# Altium schematic sheet MMI.SchDoc
size 292 x 193 mm; SheetNumber: 3; SheetTotal: 10
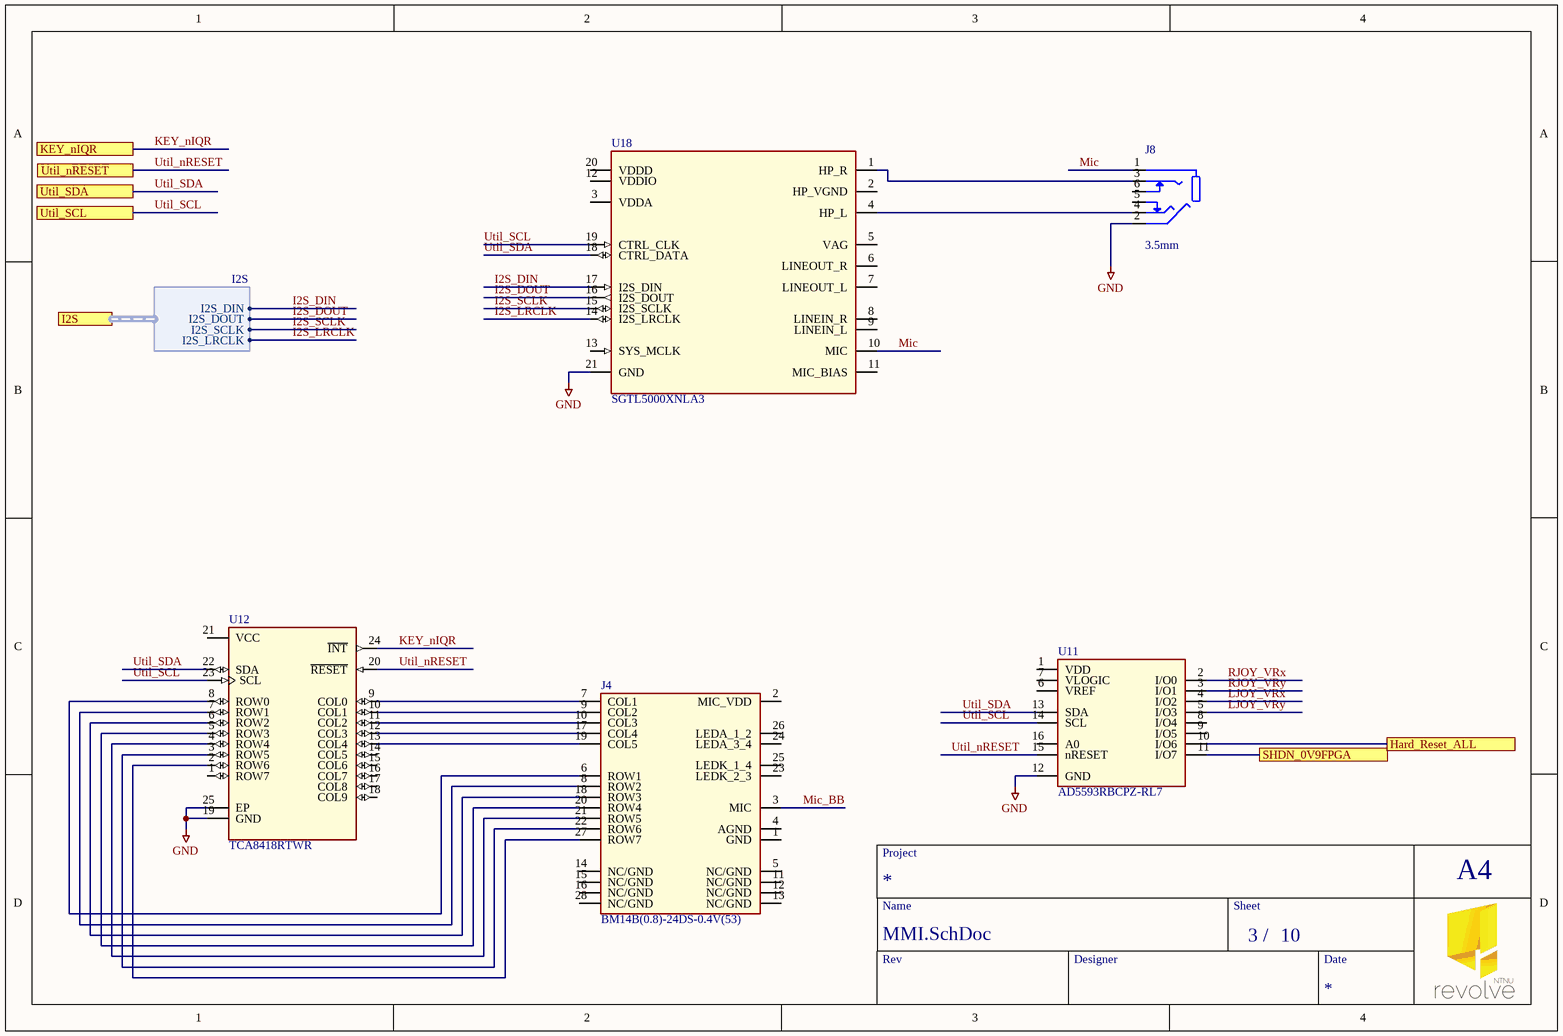
[diagram p0: MMI.SchDoc]

## Parts
J4  BM14B(0.8)-24DS-0.4V(53)  [CONN24_BM14B_HIR]
J8  3.5mm  [TENSILITY_54-00176]
U11  AD5593RBCPZ-RL7  [CP_16_32_ADI-M]
U12  TCA8418RTWR  [QFN50P400X400X80-25N]
U18  SGTL5000XNLA3  [HUQFN20_SOT1628-1_NXP-M]

## Ports
Hard_Reset_ALL, I2S (harness I2S), KEY_nIQR, SHDN_0V9FPGA, Util_nRESET, Util_SCL, Util_SDA

## Harnesses
I2S: I2S_DIN, I2S_DOUT, I2S_SCLK, I2S_LRCLK

## Nets
GND: J8.2 U11.12(GND) U12.19(GND) U12.25(EP) U18.21(GND)
Hard_Reset_ALL: U11.10(I/O6) ; port Hard_Reset_ALL
I2S_DIN: U18.17(I2S_DIN) ; port I2S.I2S_DIN
I2S_DOUT: U18.16(I2S_DOUT) ; port I2S.I2S_DOUT
I2S_LRCLK: U18.14(I2S_LRCLK) ; port I2S.I2S_LRCLK
I2S_SCLK: U18.15(I2S_SCLK) ; port I2S.I2S_SCLK
KEY_nIQR: U12.24(~{INT}) ; port KEY_nIQR
LJOY_VRx: U11.4(I/O2)
LJOY_VRy: U11.5(I/O3)
Mic: J8.1 U18.10(MIC)
Mic_BB: J4.3(MIC)
RJOY_VRx: U11.2(I/O0)
RJOY_VRy: U11.3(I/O1)
SHDN_0V9FPGA: U11.11(I/O7) ; port SHDN_0V9FPGA
Util_nRESET: U11.15(nRESET) U12.20(~{RESET}) ; port Util_nRESET
Util_SCL: U11.14(SCL) U12.23(SCL) U18.19(CTRL_CLK) ; port Util_SCL
Util_SDA: U11.13(SDA) U12.22(SDA) U18.18(CTRL_DATA) ; port Util_SDA
NetJ4_6: J4.6(ROW1) U12.8(ROW0)
NetJ4_7: J4.7(COL1) U12.9(COL0)
NetJ4_8: J4.8(ROW2) U12.7(ROW1)
NetJ4_9: J4.9(COL2) U12.10(COL1)
NetJ4_10: J4.10(COL3) U12.11(COL2)
NetJ4_17: J4.17(COL4) U12.12(COL3)
NetJ4_18: J4.18(ROW3) U12.6(ROW2)
NetJ4_19: J4.19(COL5) U12.13(COL4)
NetJ4_20: J4.20(ROW4) U12.5(ROW3)
NetJ4_21: J4.21(ROW5) U12.4(ROW4)
NetJ4_22: J4.22(ROW6) U12.3(ROW5)
NetJ4_27: J4.27(ROW7) U12.2(ROW6)
NetJ8_3: J8.3 U18.1(HP_R)
NetJ8_4: J8.4 U18.4(HP_L)

Not connected (* = marked no-connect by the designer): J4 1(GND) 2(MIC_VDD) 4(AGND) 5(NC/GND) 11(NC/GND) 12(NC/GND) 13(NC/GND) 14(NC/GND) 15(NC/GND) 16(NC/GND) 23(LEDK_2_3) 24(LEDA_3_4) 25(LEDK_1_4) 26(LEDA_1_2) 28(NC/GND); J8 5 6; U11 1(VDD) 6(VREF) 7(VLOGIC) 8(I/O4) 9(I/O5) 16(A0); U12 1(ROW7) 14(COL5) 15(COL6) 16(COL7) 17(COL8) 18(COL9) 21(VCC); U18 2(HP_VGND) 3(VDDA) 5(VAG) 6(LINEOUT_R) 7(LINEOUT_L) 8(LINEIN_R) 9(LINEIN_L) 11(MIC_BIAS) 12(VDDIO) 13(SYS_MCLK) 20(VDDD)

## Notes on the sheet
- Project
- Name
- Sheet
- A4
- Rev
- Designer
- /
- Date

## Library data of the parts
J4 = BM14B0.8-24DS-0.4V53: BB Q10 keyboard connector; Manufacturer_Name: Hirose; Type: Arrays, Edge Type, Mezzanine (Board to Board); Copyright: Copyright (C) 2025 Ultra Librarian. All rights reserved.; Manufacturer_Part_Number: BM14B(0.8)-24DS-0.4V(53); RefDes: RefDes; Supplier 1: DigiKey; Supplier Part Number 1: H122178CT-ND
J8 = 54-00176: Connector, 4C audio jack, 3.5xL14 mm, thru hole, gold plated; MF: Tensility International Corp; SnapEDA_Link: https://www.snapeda.com/parts/54-00176/Tensility/view-part/?ref=snap; Package: None; Value: *; MP: 54-00176; Check_prices: https://www.snapeda.com/parts/54-00176/Tensility/view-part/?ref=eda; Supplier 1: Arrow Electronics; Supplier Part Number 1: 54-00176
U11 = AD5593RBCPZ-RL7: 8-Channel, 12-Bit, Configurable ADC/DAC with On-Chip Reference, I2C Interface; Manufacturer_Name: Analog Devices Inc; Copyright: Copyright (C) 2025 Ultra Librarian. All rights reserved.; Manufacturer_Part_Number: AD5593RBCPZ-RL7; Datasheet: https://www.analog.com/media/en/technical-documentation/data-sheets/AD5593R.pdf; RefDes: RefDes; Type: Type
U12 = TCA8418RTWR: I2C Controlled Keypad Scan IC With Integrated ESD Protection 24-WQFN -40 to 85; MF: Texas Instruments; Purchase-URL: https://pricing.snapeda.com/search/part/TCA8418RTWR/?ref=eda; Value: *; SnapEDA_Link: https://www.snapeda.com/parts/TCA8418RTWR/Texas%20Instruments/view-part/229165/?ref=snap; Package: WQFN-24 Texas Instruments; MP: TCA8418RTWR; Digi-Key_Part_Number: 296-25223-1-ND; Check_prices: https://www.snapeda.com/parts/TCA8418RTWR/Texas%20Instruments/view-part/229165/?ref=eda
U18 = SGTL5000XNLA3: IC AUDIO CODEC STEREO 20-QFN; Manufacturer_Name: NXP; Copyright: Copyright (C) 2025 Ultra Librarian. All rights reserved.; Manufacturer_Part_Number: SGTL5000XNLA3; RefDes: RefDes; Type: Type; Supplier 1: Newark; Supplier Part Number 1: SGTL5000XNLA3